# EAGLE design YOTSUBA_+Y-Z_ver.1.0 (EAGLE 9.6.2)
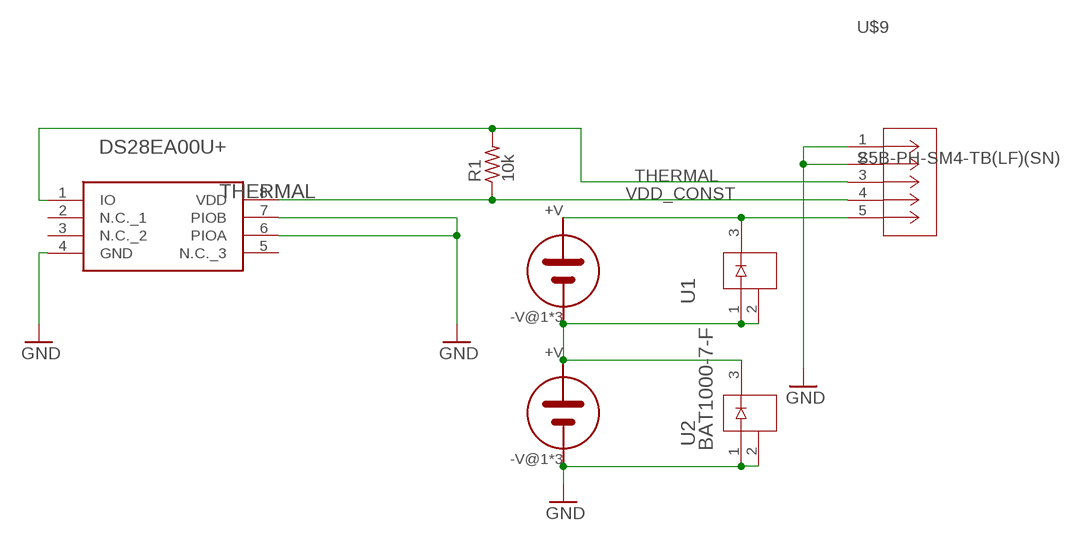
[diagram p0: schematic, sheet 1]

## Parts
R1  10k  R-US_R0805  [R0805]
THERMAL  DS28EA00U+  [SOP65P490X110-8N]
U1  BAT1000-7-F  [SOT23_BAT_DIO]
U2  BAT1000-7-F  [SOT23_BAT_DIO]
U$2  3G30A  [SOLAR_3G30A]
U$3  3G30A  [SOLAR_3G30A]
U$9  S5B-PH-SM4-TB(LF)(SN)  [CONN_S5B-PH-SM4-TB_JST]

## Nets
GND [GND]: THERMAL.4(GND) THERMAL.6(PIOA) THERMAL.7(PIOB) U2.1 U2.2 U$3.-V@1(-V) U$3.-V@2(-V) U$3.-V@3(-V) U$9.1 U$9.2
N$5: U1.1 U1.2 U2.3 U$2.-V@1(-V) U$2.-V@2(-V) U$2.-V@3(-V) U$3.+V
N$6: U1.3 U$2.+V U$9.5
THERMAL: R1.2 THERMAL.1(IO) U$9.3
VDD_CONST: R1.1 THERMAL.8(VDD) U$9.4
Unconnected: THERMAL.2(N.C._1) THERMAL.3(N.C._2) THERMAL.5(N.C._3)

## Library data of the parts
R1 = rcl:R-US_: RESISTOR, American symbol; SPICEPREFIX: R
THERMAL = DS28EA00U+:DS28EA00U+: Maxim DS28EA00U+ Temperature Sensor 8-Pin uMAX, -40 +85 C Source: Datasheet <https://datasheets.maximintegrated.com/en/ds/DS28EA00.pdf>; ARROW_PART_NUMBER: DS28EA00U+; ARROW_PRICE-STOCK: https://www.arrow.com/en/products/ds28ea00u/maxim-integrated?region=nac; DESCRIPTION: Maxim DS28EA00U+ Temperature Sensor 8-Pin uMAX, -40 +85 C; HEIGHT: 1.1mm; MANUFACTURER_NAME: Analog Devices; MANUFACTURER_PART_NUMBER: DS28EA00U+; MOUSER_PART_NUMBER: 700-DS28EA00U; MOUSER_PRICE-STOCK: https://www.mouser.co.uk/ProductDetail/Maxim-Integrated/DS28EA00U%2b?qs=7H2Jq%252ByxpJJHHt%2F9DIHuNA%3D%3D
U1 U2 = BAT1000:BAT1000-7-F; COPYRIGHT: Copyright (C) 2023 Ultra Librarian. All rights reserved.; DIGIKEY_PART_NUMBER_1: BAT1000-7FDITR-ND; DIGIKEY_PART_NUMBER_2: BAT1000-7FDICT-ND; DIGIKEY_PART_NUMBER_3: BAT1000-7FDIDKR-ND; MANUFACTURER_PART_NUMBER: BAT1000-7-F; MFR_NAME: Diodes Inc
U$2 U$3 = 3G30A_normal:3G30A
U$9 = S5B-PH-SM4:S5B-PH-SM4-TB(LF)(SN); COPYRIGHT: Copyright (C) 2023 Ultra Librarian. All rights reserved.; DIGIKEY_PART_NUMBER_1: 455-1752-2-ND; DIGIKEY_PART_NUMBER_2: 455-1752-1-ND; DIGIKEY_PART_NUMBER_3: 455-1752-6-ND; MANUFACTURER_PART_NUMBER: S5B-PH-SM4-TB(LF)(SN); MFR_NAME: JST

## Net classes
2 GND: clearance 0.5 mm to class 0, clearance 0.1 mm to class 1, clearance 0.5 mm

## Board
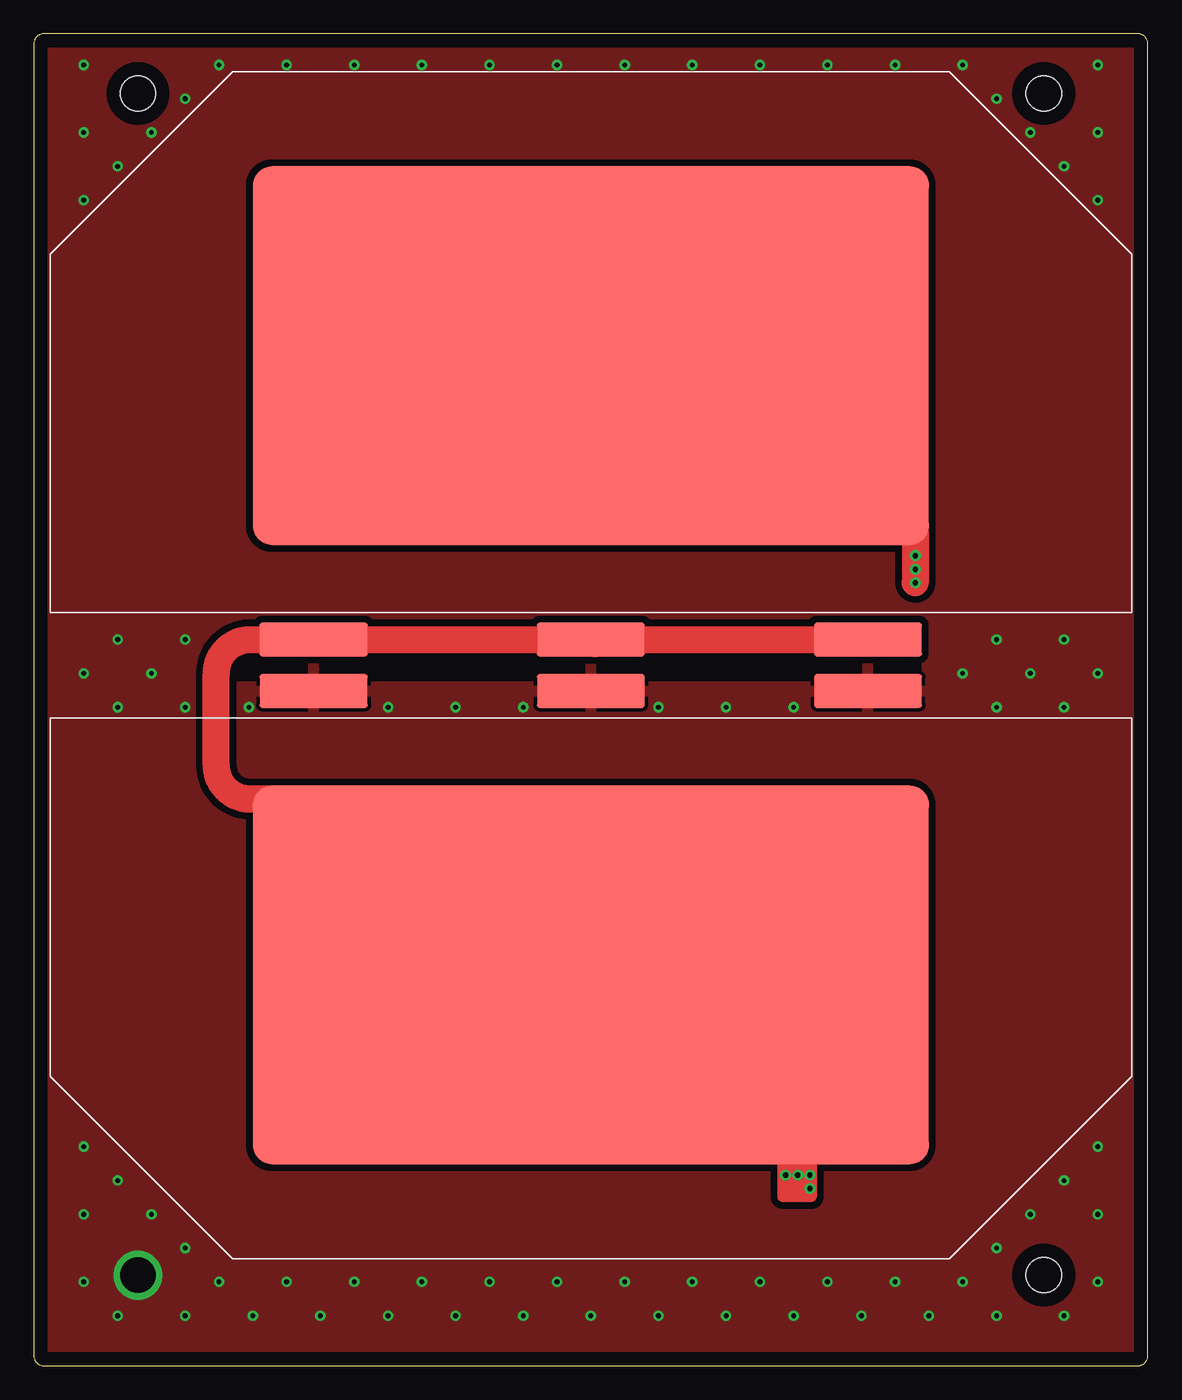
[diagram p1: board, top side]
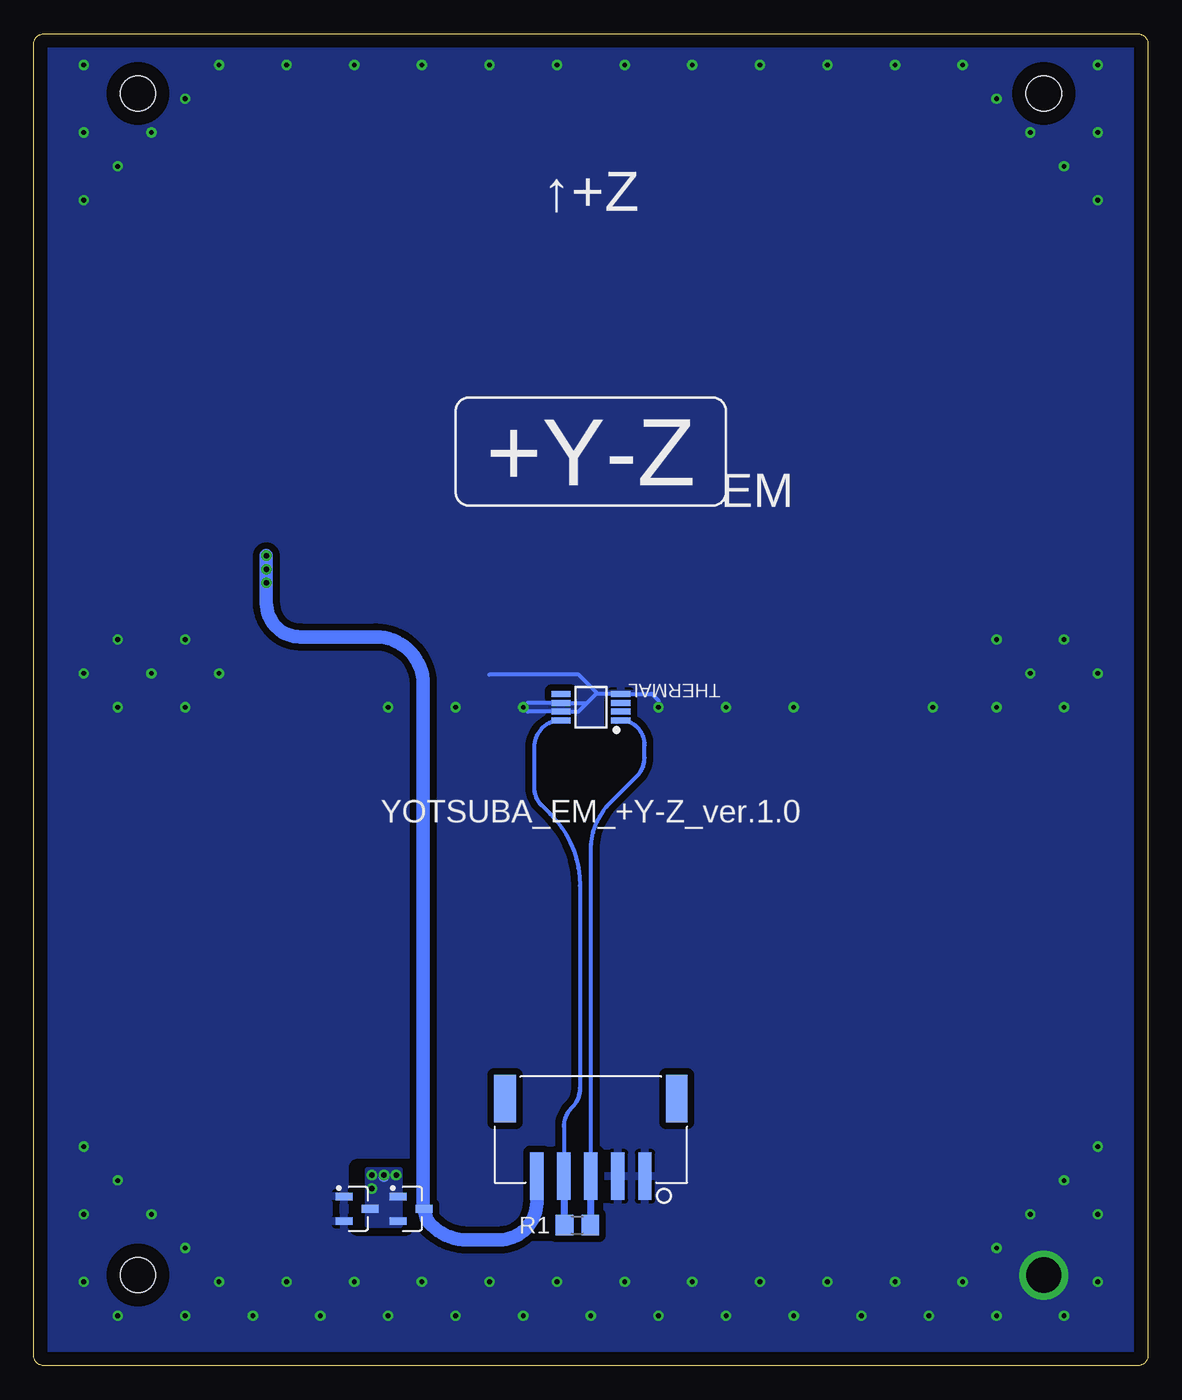
[diagram p2: board, bottom side, seen from below]

Size 82.4 x 98.5 mm. Coordinates in mm from the lower left corner, seen from the top.
Outline: 81.65,98.5 0.75,98.5 arc90 0,97.75 0,0.75 arc90 0.75,0 81.65,0 arc90 82.4,0.75 82.4,97.75 arc90 81.65,98.5
Copper layers (1*16): Top 0.035mm / dielectric 1.2mm / Bottom 0.035mm
Design rules "default *": minimum track width 6mil, minimum drill 0.35mm, track to track 6mil, track to pad 6mil, pad to pad 6mil, via to via 6mil, smd to smd 6mil, copper to edge 40mil, drill to drill 6mil, minimum pad ring 10mil, minimum via ring 8mil, stop-mask expansion 4mil, vias tented up to drill 30mil, thermal gap 10mil
Holes 2.6 mm at 74.7,6.7 7.7,94.1 74.7,94.1
tRestrict: 3 lines
bRestrict: 11 lines

### Footprints (pad centres in the part's own frame; a part is rotated, then mirrored left to right if it is on the bottom)
R0805 = smd 1.3 x 1.5: 1 -0.95,0; 2 0.95,0
SOP65P490X110-8N = smd 1.425 x 0.45: 1 -2.212,0.975; 2 -2.212,0.325; 3 -2.212,-0.325; 4 -2.212,-0.975; 5 2.212,-0.975; 6 2.212,-0.325; 7 2.212,0.325; 8 2.212,0.975
SOT23_BAT_DIO = smd 0.568 x 1.259: 1 -0.915,-0.965; 2 0.915,-0.965; 3 0,0.965
SOLAR_3G30A = smd 50 x 28: +V 0,19 | smd 8 x 2.5: -V@1 -20.5,-2; -V@2 20.5,-2; -V@3 0,-2
CONN_S5B-PH-SM4-TB_JST = smd 0.991 x 3.505: 1 4,-3.453; 2 2,-3.453; 3 0,-3.453; 4 -2,-3.453; 5 -4,-3.453 | smd 1.6 x 3.505: 6 -6.35,2.297; 7 6.35,2.297

### Placement (x,y rotation side)
R1  42.2,10.4 0 bottom
THERMAL  41.2,48.7 180 bottom
U1  54.5,11.6 270 bottom
U2  58.5,11.6 270 bottom
U$2  41.2,55.7 0 top
U$3  41.2,47.9 180 top
U$9  41.2,17.47 0 bottom

### Tracks (layer width: path | path; a pad name or v marks a point on that pad's centre or on a via)
GND  (via drill 0.35, 2.6)
  Bottom 0.3: 48.7,51.1 42.1,51.1 40.75,49.75 | 40.75,49.75 40.67,49.68 THERMAL.4 36.73,49.68 36.7,49.7 36.2,49.2 v36.2,48.7 | 41.5,49 40.75,49.75 | 41.5,49 43.31,49 THERMAL.6 45.88,49.03 v46.2,48.7 45.88,48.38 THERMAL.7 42.12,48.38 41.5,49
  other vias: 31.2,48.7 26.2,48.7 15.9,48.7 51.2,48.7 56.2,48.7 71.2,48.7 68.7,51.2 73.7,51.2 78.7,51.2 76.2,48.7 78.7,16.2 76.2,13.7 78.7,11.2 78.7,6.2 73.7,11.2 71.2,8.7 68.7,6.2 63.7,6.2 61.2,3.7 66.2,3.7 71.2,3.7 76.2,3.7 6.2,48.7 11.2,48.7 8.7,51.2 3.7,51.2 6.2,53.7 11.2,53.7 71.2,53.7 76.2,53.7 3.7,86.2 6.2,88.7 3.7,91.2 3.7,96.2 8.7,91.2 11.2,93.7 13.7,96.2 18.7,96.2 23.7,96.2 28.7,96.2 33.7,96.2 38.7,96.2 43.7,96.2 48.7,96.2 53.7,96.2 58.7,96.2 63.7,96.2 68.7,96.2 71.2,93.7 73.7,91.2 76.2,88.7 78.7,86.2 78.7,91.2 78.7,96.2 11.2,3.7 6.2,3.7 3.7,6.2 7.7,6.7 3.7,16.2 16.2,3.7 21.2,3.7 18.7,6.2 13.7,6.2 11.2,8.7 23.7,6.2 26.2,3.7 28.7,6.2 31.2,3.7 33.7,6.2 36.2,3.7 38.7,6.2 43.7,6.2 46.2,3.7 48.7,6.2 53.7,6.2 51.2,3.7 56.2,3.7 58.7,6.2 41.2,3.7 8.7,11.2 6.2,13.7 3.7,11.2
  pour Top: -0.1,0 82.3,0 arc90 82.5,0.2 82.5,97.5 arc90 81.5,98.5 0.4,98.5 arc90 -0.1,98
  pour Bottom: -4.9,-5.7 -4.9,106.1 87.2,106.1 87.2,-5.6 arc-90 86.2,-6.6 -4,-6.6 arc-90
N$5  (via drill 0.4)
  Top 0.8: U$3.+V 57.5,28.9 57.5,12.5 55.4,12.5 55.4,14.4 | 55.4,14.4 55.4,15 57.1,15 57.1,14.4 v57.4,14.1 57.1,13.8 | 56.5,13.1 55.9,13.1 55.9,14 56.5,14 | v56.5,14.1 56.5,13.1 | v56.5,14.1 56.5,14.4 55.4,14.4 | v56.5,14.1 56.8,13.8 57.1,13.8 | 57.1,13.8 57.1,13.4 v57.4,13.1 56.5,13.1
  Top 2: U$2.-V@3 41.5,53.4 41.7,53.6 | 41.7,53.6 41.4,53.6 U$2.-V@3 | U$3.+V 21.5,28.9 21.5,41.9 16,41.9 arc-90 13.5,44.4 13.5,51.2 arc-90 16,53.7 U$2.-V@1 41.7,53.7 41.7,53.6 | U$2.-V@3 U$2.-V@2 | U$2.-V@2 62.7,53.7 | 62.7,53.8 61.7,53.8 U$2.-V@2
  Bottom 0.8: v56.5,14.1 56.5,14
  other vias: 55.6,14.1
  pour Bottom (no thermals): 55.3,14.5 57.7,14.5 57.7,10.4 55.3,10.4
N$6  (via drill 0.4)
  Top 2: U$2.+V 41.49,74.7 54.2,61.7 65.2,61.7 v65.2,57.9
  Bottom 1: v65.2,59.9 v65.2,58.9 v65.2,57.9 65.2,56.4 arc-90 62.7,53.9 57.1,53.9 arc90 53.6,50.4 53.6,11.6 U1.3 53.49,11.56 arc-45 53.02,10.41 arc-45 50.33,9.3 48,9.3 arc-90 45.2,12.1 U$9.5
THERMAL
  Bottom 0.3: U$9.3 41.2,38.13 arc45 39.74,41.66 37.79,43.61 arc-45 37.23,44.97 37.23,45.89 arc-90 THERMAL.1 | 41.38,10.42 R1.2 41.2,10.61
  Bottom 0.508: 41.2,10.61 U$9.3
VDD_CONST
  Bottom 0.3: THERMAL.8 THERMAL.8 arc-90 45.4,45.73 45.4,42.77 arc-45 44.85,41.45 44.2,40.8 arc45 42.01,35.51 42.01,20.52 arc45 42.6,19.1 42.61,19.09 arc-45 43.2,17.67 U$9.4 | R1.1 43.19,10.6
  Bottom 0.508: U$9.4 43.19,10.6

### Text on the board
bNames: ↑+Z | +Y-Z | EM | YOTSUBA_EM_+Y-Z_ver.1.0